# EAGLE design WaveTooEasy_V1.2 (EAGLE 7.6.0)
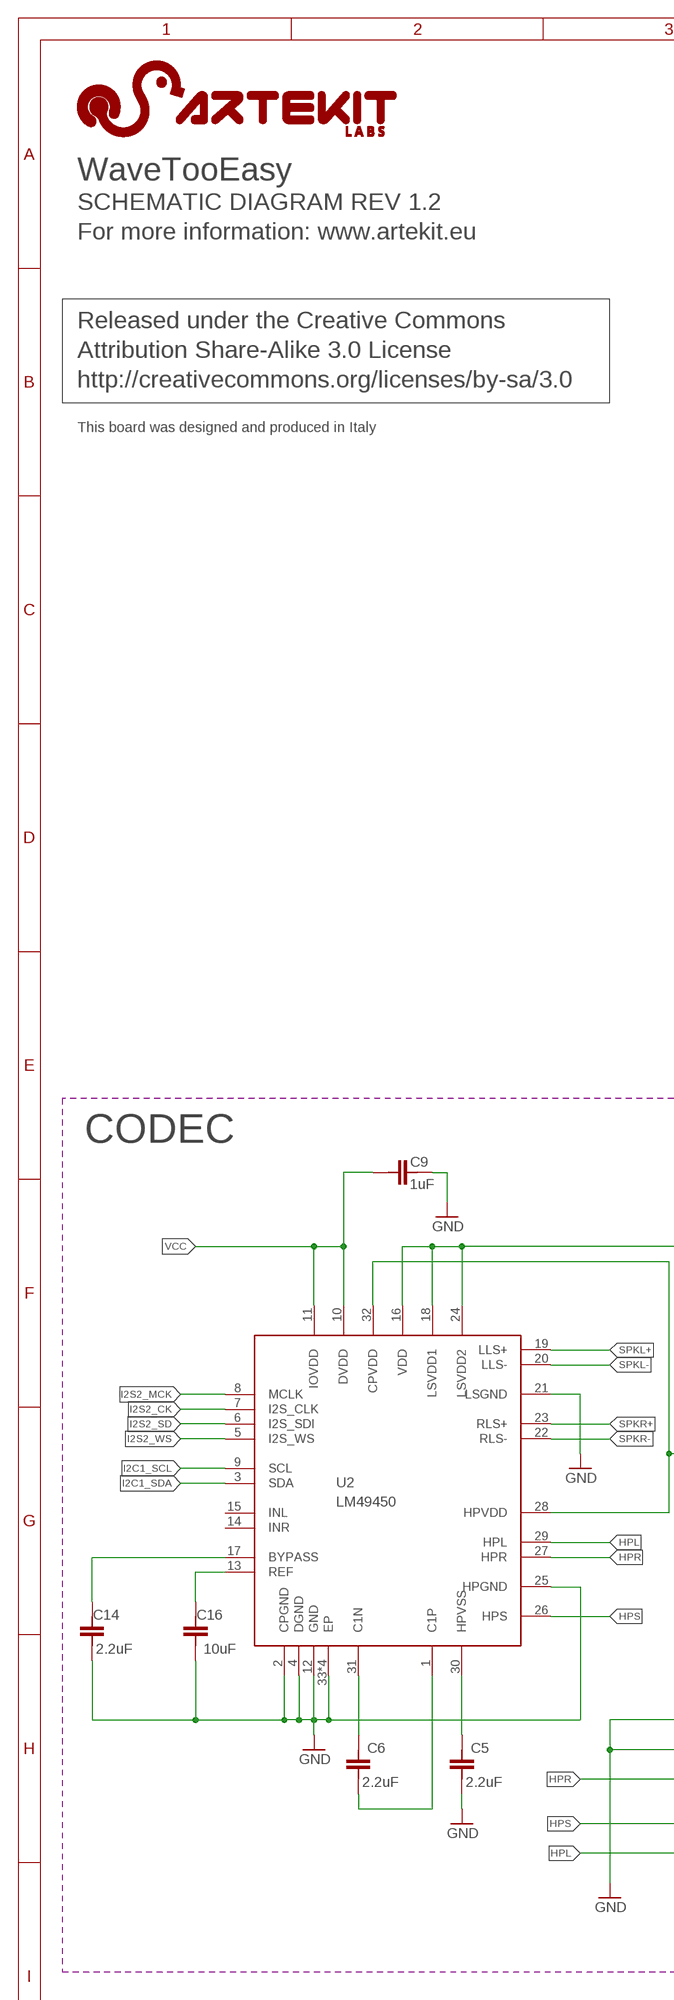
[diagram p0: schematic, sheet 1, part 1 of 2]
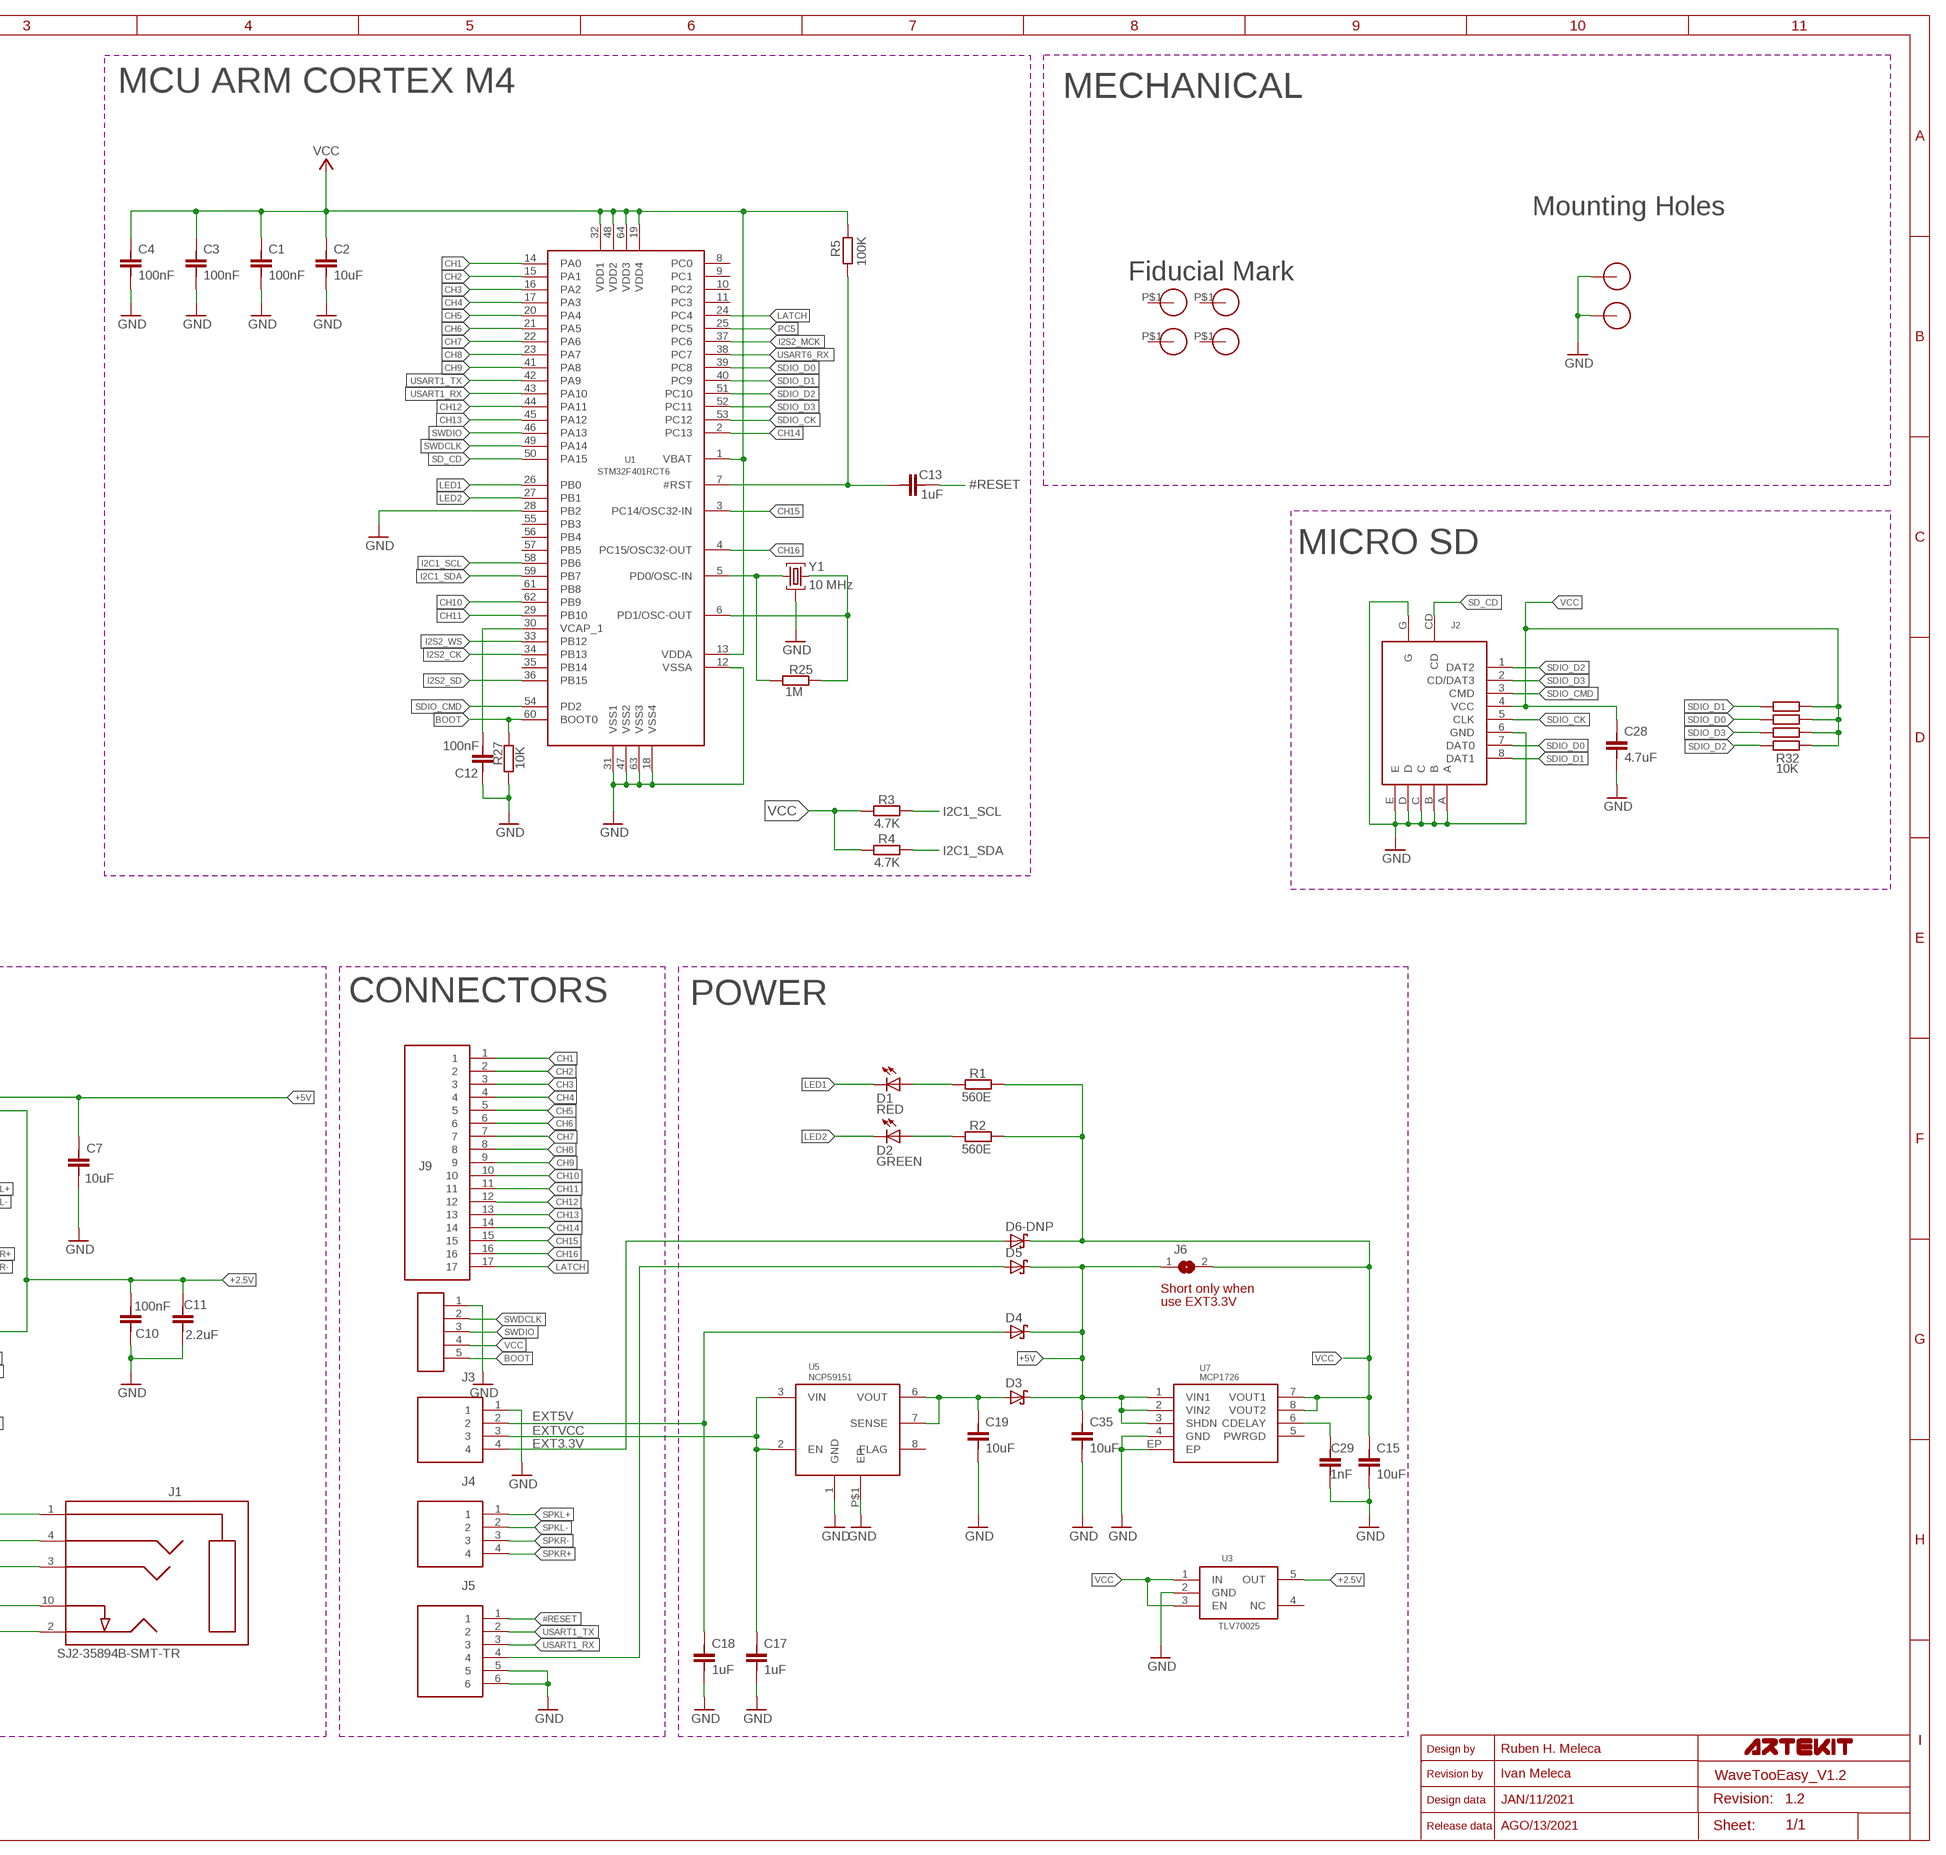
[diagram p1: schematic, sheet 1, part 2 of 2]

## Parts
C1  100nF  C0402  [C0402]
C2  10uF  C0402  [C0402]
C3  100nF  C0402  [C0402]
C4  100nF  C0402  [C0402]
C5  2.2uF  C0402  [C0402]
C6  2.2uF  C0402  [C0402]
C7  10uF  C0402  [C0402]
C9  1uF  C0402  [C0402]
C10  100nF  C0402  [C0402]
C11  2.2uF  C0402  [C0402]
C12  100nF  C0402  [C0402]
C13  1uF  C0402  [C0402]
C14  2.2uF  C0402  [C0402]
C15  10uF  C0402  [C0402]
C16  10uF  C0402  [C0402]
C17  1uF  C0402  [C0402]
C18  1uF  C0402  [C0402]
C19  10uF  C0402  [C0402]
C28  4.7uF  C0402  [C0402]
C29  1nF  C0402  [C0402]
C35  10uF  C0402  [C0402]
D1  RED  LED0603-RED  [CHIPLED_0603]
D2  GREEN  LED0603-RED  [CHIPLED_0603]
D3  BAT60  DIO-SCHOTTKY-10V-1A-BAT60JFILM  [SOD-323]
D4  BAT60  DIO-SCHOTTKY-10V-1A-BAT60JFILM  [SOD-323]
D5  BAT60  DIO-SCHOTTKY-10V-1A-BAT60JFILM  [SOD-323]
D6-DNP  BAT60  DIO-SCHOTTKY-10V-1A-BAT60JFILM  [SOD-323]
J1  SJ2-35894B-SMT-TR  [SJ2-35894B-SMT-TR]
J2  MICRO-SD-CON-MOLEX-503182-0852  [MICRO-SD-CON-MOLEX-503182-0852]
J3  CON-PH-1X04-P01"2  [PIN-HEADER-1X04-NODASH]
J4  CON-PH-1X04-P01"2  [PIN-HEADER-1X04-NODASH]
J5  CON-PH-1X06-P0.1"1  [PIN-HEADER-1X6-NODASH]
J6  JUMPER-2  [JUMPER-2]
J9  CON-PH-1X17-P0.1  [PIN-HEADER-1X17-NODASH]
R1  560E  R0402  [R0402]
R2  560E  R0402  [R0402]
R3  4.7K  R0402  [R0402]
R4  4.7K  R0402  [R0402]
R5  100K  R0402  [R0402]
R25  1M  R0402  [R0402]
R27  10K  R0402  [R0402]
R32  10K  RESISTOR-ARRAY-X4-0603  [RES-ARRAY-0603]
U1  STM32F401RCT6  STM32F401RBT6  [LQFP64-10X10-P0.50]
U2  LM49450  [QFN32-5X5-P0.50]
U3  TLV70025  REG-TLV70025DCKR-2.5V-200MA  [SOT363-5]
U5  NCP59151  NCP59151MN50TYG  [DFN8-4X4]
U7  MCP1726  MCP1726-3.3V-DFN8-3X3  [DFN8-3X3]
U$1  CON-PH-1X05-P0.1"  [PIN-HEADER-1X05-NODASH]
U$3  HOLE-2MM-METALIZED  [HOLE-2MM-METALIZED]
U$4  HOLE-2MM-METALIZED  [HOLE-2MM-METALIZED]
U$5  FIDUTIAL_1.2MM  [FIDUTIAL_1.2MM]
U$6  FIDUTIAL_1.2MM  [FIDUTIAL_1.2MM]
U$8  FIDUTIAL_1.2MM  [FIDUTIAL_1.2MM]
U$9  FIDUTIAL_1.2MM  [FIDUTIAL_1.2MM]
Y1  10 MHz  RESONATOR-MURATA-CSTCE8M00G55-R0  [RESONATOR-MURATA-CSTCE-SERIES]

## Nets
#RESET: C13.2 J5.1
+2.5V: C10.1 C11.1 U2.28(HPVDD) U2.32(CPVDD) U3.5(OUT)
+5V: C7.1 C35.1 D3.C D4.C D5.C J6.1 U2.16(VDD) U2.18(LSVDD1) U2.24(LSVDD2) U7.1(VIN1) U7.2(VIN2) U7.3(SHDN)
BOOT: R27.2 U1.60(BOOT0) U$1.5
CH1: J9.1 U1.14(PA0)
CH2: J9.2 U1.15(PA1)
CH3: J9.3 U1.16(PA2)
CH4: J9.4 U1.17(PA3)
CH5: J9.5 U1.20(PA4)
CH6: J9.6 U1.21(PA5)
CH7: J9.7 U1.22(PA6)
CH8: J9.8 U1.23(PA7)
CH9: J9.9 U1.41(PA8)
CH10: J9.10 U1.62(PB9)
CH11: J9.11 U1.29(PB10)
CH12: J9.12 U1.44(PA11)
CH13: J9.13 U1.45(PA12)
CH14: J9.14 U1.2(PC13)
CH15: J9.15 U1.3(PC14/OSC32-IN)
CH16: J9.16 U1.4(PC15/OSC32-OUT)
EXT3.3V: D6-DNP.A J3.4
EXT5V: C18.1 D4.A J3.2
EXTVCC: C17.1 J3.3 U5.2(EN) U5.3(VIN)
GND: C1.2 C2.2 C3.2 C4.2 C5.2 C7.2 C9.2 C10.2 C11.2 C12.2 C14.2 C15.2 C16.2 C17.2 C18.2 C19.2 C28.2 C29.2 C35.2 J1.1 J1.4 J2.6(GND) J2.A J2.B J2.C J2.D J2.E J2.G J3.1 J5.5 J5.6 R27.1 U1.12(VSSA) U1.18(VSS4) U1.28(PB2) U1.31(VSS1) U1.47(VSS2) U1.63(VSS3) U2.2(CPGND) U2.4(DGND) U2.12(GND) U2.21(LSGND) U2.25(HPGND) U2.33(EP) U2.34(EP) U2.35(EP) U2.36(EP) U3.2(GND) U5.1(GND) U5.P$1(EP) U7.4(GND) U7.EP U$1.1 U$3.1 U$4.1 Y1.2
HPL: J1.2 U2.29(HPL)
HPR: J1.3 U2.27(HPR)
HPS: J1.10 U2.26(HPS)
I2C1_SCL: R3.1 U1.58(PB6) U2.9(SCL)
I2C1_SDA: R4.1 U1.59(PB7) U2.3(SDA)
I2S2_CK: U1.34(PB13) U2.7(I2S_CLK)
I2S2_MCK: U1.37(PC6) U2.8(MCLK)
I2S2_SD: U1.36(PB15) U2.6(I2S_SDI)
I2S2_WS: U1.33(PB12) U2.5(I2S_WS)
LATCH: J9.17 U1.24(PC4)
LED1: D1.C U1.26(PB0)
LED2: D2.C U1.27(PB1)
N$1: C19.1 D3.A U5.6(VOUT) U5.7(SENSE)
N$2: C6.1 U2.31(C1N)
N$3: C6.2 U2.1(C1P)
N$4: C5.1 U2.30(HPVSS)
N$5: C16.1 U2.13(REF)
N$6: C14.1 U2.17(BYPASS)
N$8: D5.A J5.4
N$9: C13.1 R5.1 U1.7(#RST)
N$10: R25.1 U1.5(PD0/OSC-IN) Y1.1
N$11: R25.2 U1.6(PD1/OSC-OUT) Y1.3
N$12: D2.A R2.2
N$13: D1.A R1.2
N$41: C29.1 U7.6(CDELAY)
N$42: C12.1 U1.30(VCAP_1)
PC5: U1.25(PC5)
SD_CD: J2.CD U1.50(PA15)
SDIO_CK: J2.5(CLK) U1.53(PC12)
SDIO_CMD: J2.3(CMD) U1.54(PD2)
SDIO_D0: J2.7(DAT0) R32.3 U1.39(PC8)
SDIO_D1: J2.8(DAT1) R32.1 U1.40(PC9)
SDIO_D2: J2.1(DAT2) R32.7 U1.51(PC10)
SDIO_D3: J2.2(CD/DAT3) R32.5 U1.52(PC11)
SPKL+: J4.1 U2.19(LLS+)
SPKL-: J4.2 U2.20(LLS-)
SPKR+: J4.4 U2.23(RLS+)
SPKR-: J4.3 U2.22(RLS-)
SWDCLK: U1.49(PA14) U$1.2
SWDIO: U1.46(PA13) U$1.3
USART1_RX: J5.3 U1.43(PA10)
USART1_TX: J5.2 U1.42(PA9)
USART6_RX: U1.38(PC7)
VCC: C1.1 C2.1 C3.1 C4.1 C9.1 C15.1 C28.1 D6-DNP.C J2.4(VCC) J6.2 R1.1 R2.1 R3.2 R4.2 R5.2 R32.2 R32.4 R32.6 R32.8 U1.1(VBAT) U1.13(VDDA) U1.19(VDD4) U1.32(VDD1) U1.48(VDD2) U1.64(VDD3) U2.10(DVDD) U2.11(IOVDD) U3.1(IN) U3.3(EN) U7.7(VOUT1) U7.8(VOUT2) U$1.4
Unconnected: U1.8(PC0) U1.9(PC1) U1.10(PC2) U1.11(PC3) U1.35(PB14) U1.55(PB3) U1.56(PB4) U1.57(PB5) U1.61(PB8) U2.14(INR) U2.15(INL) U3.4(NC) U5.8(FLAG) U7.5(PWRGD) U$5.P$1 U$6.P$1 U$8.P$1 U$9.P$1

## Notes on the sheet
- MCU ARM CORTEX M4 | MECHANICAL
- WaveTooEasy
- SCHEMATIC DIAGRAM REV 1.2
- For more information: www.artekit.eu | Mounting Holes
- Fiducial Mark
- Released under the Creative Commons
- Attribution Share-Alike 3.0 License
- http://creativecommons.org/licenses/by-sa/3.0
- This board was designed and produced in Italy
- MICRO SD
- CODEC | CONNECTORS | POWER
- Short only when
- use EXT3.3V
- Design by | Ruben H. Meleca
- Revision by | Ivan Meleca
- Design data | JAN/11/2021 | Revision: | 1.2
- Release data | AGO/13/2021 | Sheet:

## Library data of the parts
C1-C7 C9-C19 C28 C29 C35 = artekit:C0402: CAP SMD 0402 NP; MF: unknown; MPN: unknown
D1 D2 = artekit:LED0603-RED: Standard LEDs - SMD Super Red, 633nm 180mcd, 20mA; MF: Osram; MPN: LTST-C191KRKT; OC_DIGIKEY: 475-2512-1-ND; OC_MOUSER: 720-LSQ976-NR-1
D3-D5 D6-DNP = artekit:DIO-SCHOTTKY-10V-1A-BAT60JFILM: Schottky Diodes & Rectifiers 3.0 Amp 10 Volt; MF: ST Microelectronics; MPN: BAT60JFILM; OC_DIGIKEY: 497-3707-1-ND; OC_FARNEL: 1467544; OC_MOUSER: 511-BAT60JFILM
J1 = ak:SJ2-35894B-SMT-TR: Jack SMD CUI SJ2-35894B-SMT-TR; MF: CUI Audio; MPN: SJ2-35894B-SMT-TR; OC_DIGIKEY: CP-SJ2-35894B-SMT-CT-ND; OC_MOUSER: 490-SJ2-35894BSMT-TR
J2 = artekit:MICRO-SD-CON-MOLEX-503182-0852: MicroSD connector Molex 503182-0852; MF: Molex; MPN: 503182-1852; OC_MOUSER: 538-503182-1852
J3 J4 = artekit:CON-PH-1X04-P01"
J5 = artekit:CON-PH-1X06-P0.1": CON-Pin Header 1x06 Pitch 0.1"; MF: unknown; MPN: unknown
J6 = artekit:JUMPER-2: 2-Way Solder Option; MF: unknown; MPN: unknown
J9 = ak:CON-PH-1X17-P0.1
R1-R5 R25 R27 = artekit:R0402: RES SMD 0402; MF: unknown; MPN: unknown
R32 = artekit:RESISTOR-ARRAY-X4-0603: Resistor Array X4 0603
U1 = ak:STM32F401RBT6: ARM Cortex M4 STM32F401RBT6 LFP64; MF: ST Microelectronics; MPN: STM32F401RCT6; OC_MOUSER: 511-STM32F401RCT6
U2 = ak:LM49450: LM49450 Stereo Codec with Class D amplifier and Headphones; MF: Texas Instruments; MPN: LM49450SQ; OC_DEGIKEY: LM49450SQ/NOPBCT-ND; OC_MOUSER: 26-LM49450SQ/NOPB
U3 = artekit:REG-TLV70025DCKR-2.5V-200MA: 2.5V 200mA LDO Regulator; MF: Texas Instruments; MPN: TLV70025DCKR; OC_MOUSER: 595-TLV70025DCKR
U5 = artekit:NCP59151MN50TYG: 5V 1.5 A, Very Low-Dropout(VLDO) Fast TransientResponse Regulator Series; MF: ON Semiconductors; MPN: NCP59151MN50TYG; OC_DIGIKEY: NCP59151MN50TYGOSTR-ND; OC_MOUSER: 863-NCP59151MN50TYG
U7 = artekit:MCP1726-3.3V-DFN8-3X3: 1A 3.3V Low Quiescent Current LDO Regulator; MF: Microchip; MPN: MCP1726T-3302E/MF; OC_DIGIKEY: MCP1726T-3302E/MF-ND; OC_FARNELL: 1851970; OC_MOUSER: 579-MCP1726T3302E/MF
U$1 = ak:CON-PH-1X05-P0.1"
U$3 U$4 = artekit:HOLE-2MM-METALIZED: Metalized hole 2mm
U$5 U$6 U$8 U$9 = artekit:FIDUTIAL_1.2MM
Y1 = ak:RESONATOR-MURATA-CSTCE8M00G55-R0: Resonator 8MHz 0.5%; MF: Murata; MPN: CSTCE8M00G55-R0; OC_DIGIKEY: 490-1195-1-ND; OC_FARNELL: 2443270; OC_MOUSER: 81-CSTCE8M00G55-R0

## Board
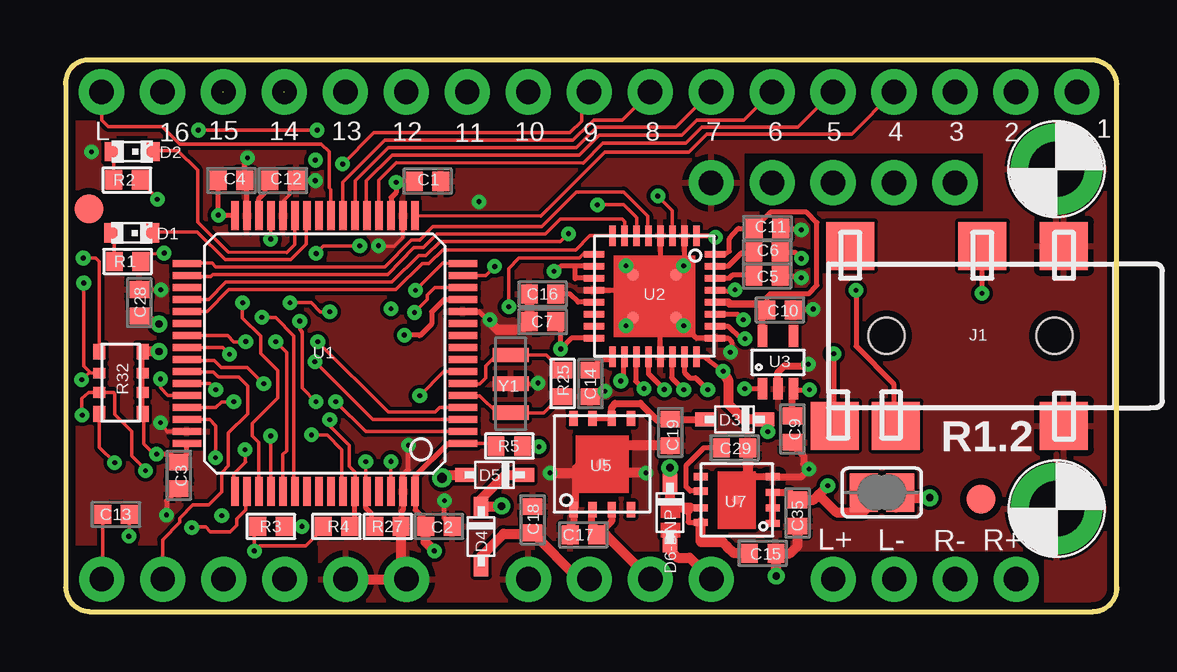
[diagram p2: board, top side]
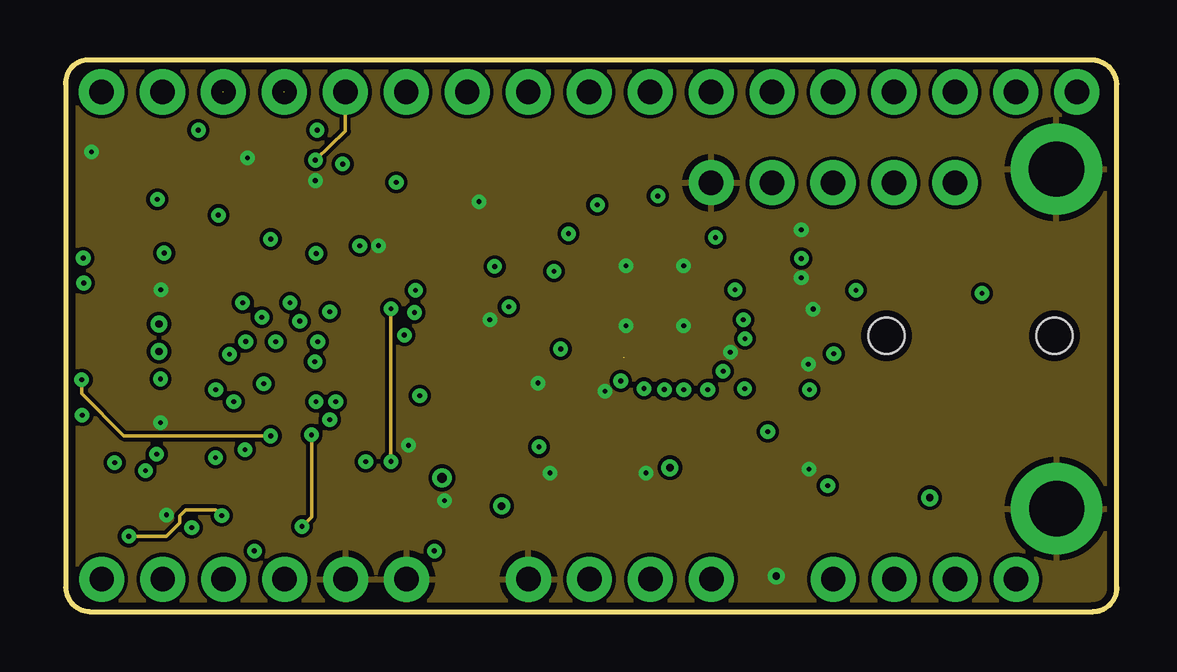
[diagram p3: board, inner layer GND]
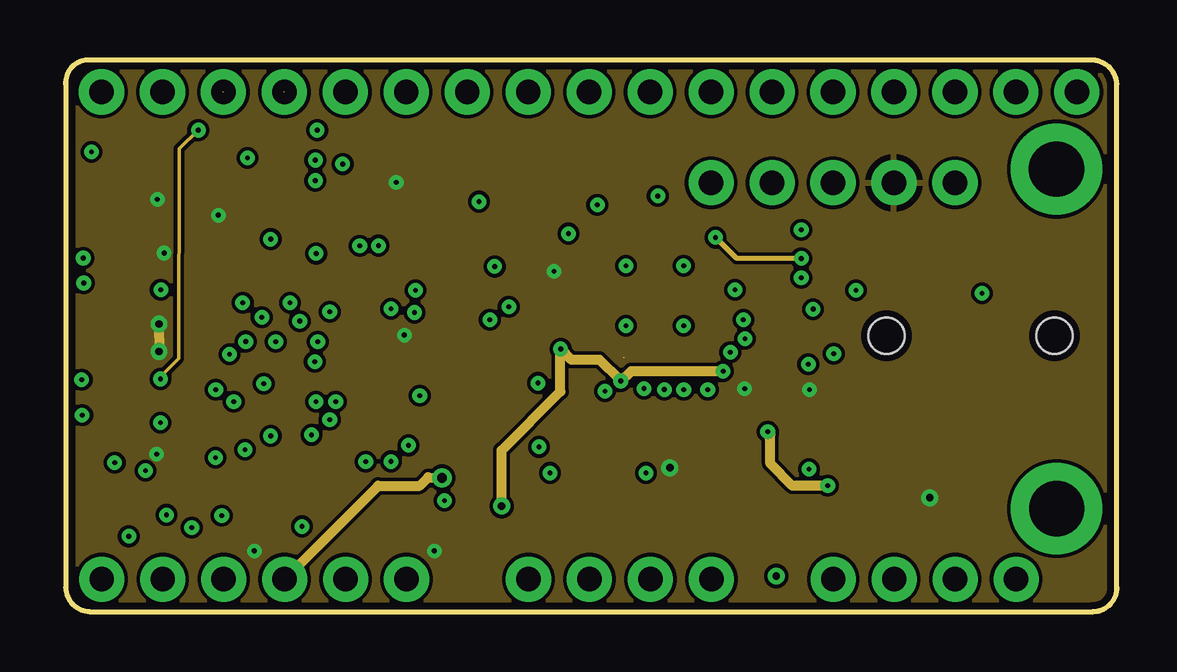
[diagram p4: board, inner layer VCC]
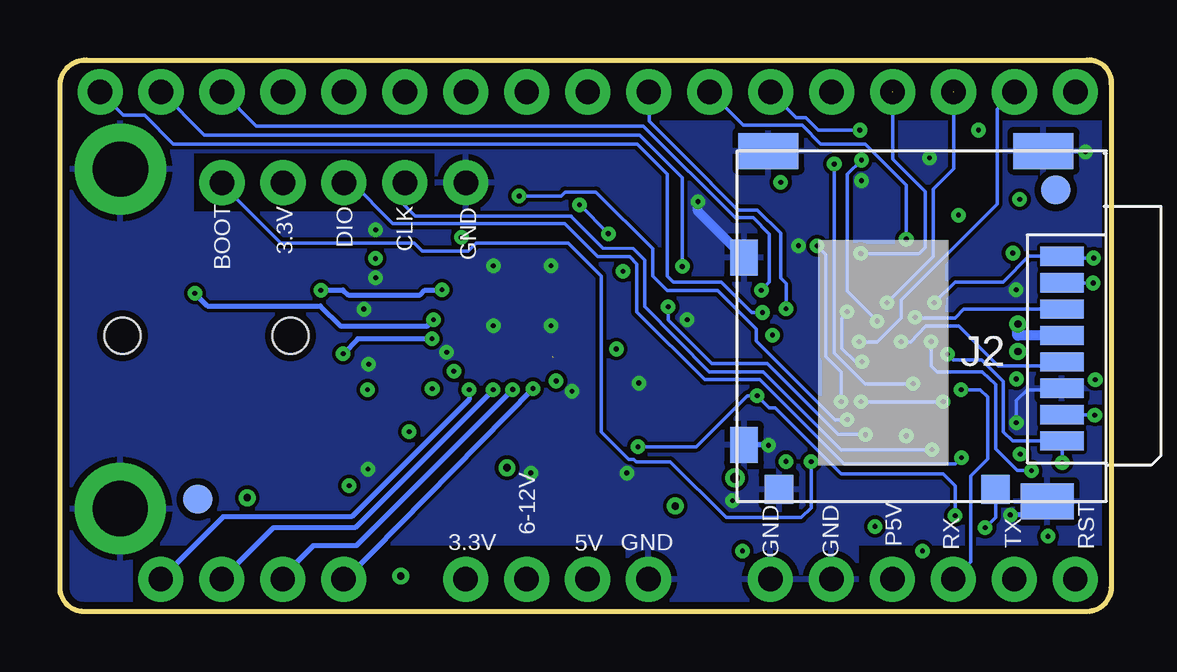
[diagram p5: board, bottom side, seen from below]

Size 43.8 x 23 mm. Coordinates in mm from the lower left corner, seen from the top.
Outline: 1,0 42.8,0 arc90 43.8,1 43.8,22 arc88 42.7,23 1,23 arc97 0,22 0,1 arc87 1,0
Copper layers (1*16): Top 0.035mm / dielectric 1.5mm / Bottom 0.035mm
Design rules "artekit": minimum track width 0.15mm, minimum drill 0.2mm, track to track 0.15mm, track to pad 0.15mm, pad to pad 0.2mm, via to via 0.15mm, smd to smd 0mil, copper to edge 0.3mm, drill to drill 8mil, minimum pad ring 10mil, minimum via ring 8mil, stop-mask expansion 4mil, vias tented up to drill 20mil, thermal gap 10mil
tRestrict: area 0.3,20.5 to 43.5,22.8; area 0.3,0.2 to 10.5,2.8; area 20.3,0.2 to 40.8,2.5; area 28.3,16.7 to 38.2,19.1
bRestrict: area 0.3,20.5 to 43.5,22.8; area 0.3,0.2 to 10.5,2.8; area 20.3,0.2 to 40.8,2.8; area 28.2,16.7 to 38.2,19.1

### Footprints (pad centres in the part's own frame; a part is rotated, then mirrored left to right if it is on the bottom)
C0402 = smd 0.7 x 0.8: 1 -0.55,0; 2 0.55,0
CHIPLED_0603 = smd 0.8 x 0.8: A 0,-0.75; C 0,0.75
SOD-323 = smd 0.8 x 0.6: A 1.25,0; C -1.25,0
SJ2-35894B-SMT-TR = smd 2 x 2: 1 2.1,-3.75; 2 9.1,3.75; 3 5.5,-3.75; 4 2.1,3.75; 10 11.65,3.75; 11 11,-3.75 | hole 1.5: 2.5,0; 9.5,0
MICRO-SD-CON-MOLEX-503182-0852 = smd 0.8 x 1.8: 1 -3.31,6.15; 2 -2.21,6.15; 3 -1.11,6.15; 4 -0.01,6.15; 5 1.09,6.15; 6 2.19,6.15; 7 3.29,6.15; 8 4.39,6.15 | smd 1.5 x 2.5: A -7.7,5.37; B -7.7,-6.08 | smd 1.5 x 1.15: C -3.27,-7.1; D 4.55,-7.1 | smd 1.2 x 1.2: CD 6.4,3.38; G 6.4,-5.64 | smd 1.5 x 2.2: E 6.9,5.53
PIN-HEADER-1X04-NODASH = drill 1.016 pad 1.88: 1 0,0; 2 2.54,0; 3 5.08,0; 4 7.62,0
PIN-HEADER-1X6-NODASH = drill 1.016 pad 1.88: 1 0,0; 2 2.54,0; 3 5.08,0; 4 7.62,0; 5 10.16,0; 6 12.7,0
JUMPER-2 = smd 1.168 x 1.6: 1 -0.762,0; 2 0.762,0
PIN-HEADER-1X17-NODASH = drill 1.016 pad 1.88: 1 0,0; 2 2.54,0; 3 5.08,0; 4 7.62,0; 5 10.16,0; 6 12.7,0; 7 15.24,0; 8 17.78,0; 9 20.32,0; 10 22.86,0; 11 25.4,0; 12 27.94,0; 13 30.48,0; 14 33.02,0; 15 35.56,0; 16 38.1,0; 17 40.64,0
R0402 = smd 0.7 x 0.8: 1 -0.55,0; 2 0.55,0
RES-ARRAY-0603 = smd 0.65 x 0.5: 1 -1.3,0.9; 2 -1.3,-0.9; 7 1.3,0.9; 8 1.3,-0.9 | smd 0.45 x 0.5: 3 -0.4,0.9; 4 -0.4,-0.9; 5 0.4,0.9; 6 0.4,-0.9
LQFP64-10X10-P0.50 = smd 1.2 x 0.3: 1 -5.75,3.75; 2 -5.75,3.25; 3 -5.75,2.75; 4 -5.75,2.25; 5 -5.75,1.75; 6 -5.75,1.25; 7 -5.75,0.75; 8 -5.75,0.25; 9 -5.75,-0.25; 10 -5.75,-0.75; 11 -5.75,-1.25; 12 -5.75,-1.75; 13 -5.75,-2.25; 14 -5.75,-2.75; 15 -5.75,-3.25; 16 -5.75,-3.75; 33 5.75,-3.75; 34 5.75,-3.25; 35 5.75,-2.75; 36 5.75,-2.25; 37 5.75,-1.75; 38 5.75,-1.25; 39 5.75,-0.75; 40 5.75,-0.25; 41 5.75,0.25; 42 5.75,0.75; 43 5.75,1.25; 44 5.75,1.75; 45 5.75,2.25; 46 5.75,2.75; 47 5.75,3.25; 48 5.75,3.75 | smd 0.3 x 1.2: 17 -3.75,-5.75; 18 -3.25,-5.75; 19 -2.75,-5.75; 20 -2.25,-5.75; 21 -1.75,-5.75; 22 -1.25,-5.75; 23 -0.75,-5.75; 24 -0.25,-5.75; 25 0.25,-5.75; 26 0.75,-5.75; 27 1.25,-5.75; 28 1.75,-5.75; 29 2.25,-5.75; 30 2.75,-5.75; 31 3.25,-5.75; 32 3.75,-5.75; 49 3.75,5.75; 50 3.25,5.75; 51 2.75,5.75; 52 2.25,5.75; 53 1.75,5.75; 54 1.25,5.75; 55 0.75,5.75; 56 0.25,5.75; 57 -0.25,5.75; 58 -0.75,5.75; 59 -1.25,5.75; 60 -1.75,5.75; 61 -2.25,5.75; 62 -2.75,5.75; 63 -3.25,5.75; 64 -3.75,5.75
QFN32-5X5-P0.50 = smd 0.85 x 0.27: 1 -2.525,1.75; 2 -2.525,1.25; 3 -2.525,0.75; 4 -2.525,0.25; 5 -2.525,-0.25; 6 -2.525,-0.75; 7 -2.525,-1.25; 8 -2.525,-1.75; 17 2.525,-1.75; 18 2.525,-1.25; 19 2.525,-0.75; 20 2.525,-0.25; 21 2.525,0.25; 22 2.525,0.75; 23 2.525,1.25; 24 2.525,1.75 | smd 0.27 x 0.85: 9 -1.75,-2.525; 10 -1.25,-2.525; 11 -0.75,-2.525; 12 -0.25,-2.525; 13 0.25,-2.525; 14 0.75,-2.525; 15 1.25,-2.525; 16 1.75,-2.525; 25 1.75,2.525; 26 1.25,2.525; 27 0.75,2.525; 28 0.25,2.525; 29 -0.25,2.525; 30 -0.75,2.525; 31 -1.25,2.525; 32 -1.75,2.525 | smd 0.5 x 0.5: 33 -0.9,0.9; 34 -0.9,-0.9; 35 0.9,-0.9; 36 0.9,0.9
SOT363-5 = smd 0.4 x 0.9: 1 -0.65,-1.1; 2 0,-1.1; 3 0.65,-1.1; 4 0.65,1.1; 5 -0.65,1.1
DFN8-4X4 = smd 0.63 x 0.35: 1 -1.9,1.2; 2 -1.9,0.4; 3 -1.9,-0.4; 4 -1.9,-1.2; 5 1.9,-1.2; 6 1.9,-0.4; 7 1.9,0.4; 8 1.9,1.2 | smd 0.5 x 0.5: P$1 0,0
DFN8-3X3 = smd 0.6 x 0.3: 1 -1.5,0.975; 2 -1.5,0.325; 3 -1.5,-0.325; 4 -1.5,-0.975; 5 1.5,-0.975; 6 1.5,-0.375; 7 1.5,0.325; 8 1.5,0.925 | smd 0.4 x 0.4: EP 0,0
PIN-HEADER-1X05-NODASH = drill 1.016 pad 1.88: 1 0,0; 2 2.54,0; 3 5.08,0; 4 7.62,0; 5 10.16,0
HOLE-2MM-METALIZED = drill 2.3 pad 3.81: 1 0,0
FIDUTIAL_1.2MM = smd 1.2 x 1.2: P$1 0,0
RESONATOR-MURATA-CSTCE-SERIES = smd 0.6 x 1.5: 1 -1.2,0; 2 0,0; 3 1.2,0

### Placement (x,y rotation side)
C1  15.08,17.94 0 top
C2  15.55,3.55 0 top
C3  4.71,5.68 270 top
C4  6.91,17.98 0 top
C5  29.23,14 0 top
C6  29.23,14.99 0 top
C7  19.87,12.09 180 top
C9  30.28,7.61 270 top
C10  29.76,12.58 0 top
C11  29.24,15.98 0 top
C12  9.05,17.98 0 top
C13  2.09,4.05 180 top
C14  21.86,9.51 270 top
C15  29.04,2.43 0 top
C16  19.87,13.24 180 top
C17  21.57,3.2 180 top
C18  19.45,3.83 90 top
C19  25.19,7.47 270 top
C28  3.07,12.88 90 top
C29  27.87,6.83 0 top
C35  30.49,4.11 270 top
D1  2.75,15.79 270 top
D2  2.77,19.18 270 top
D3  27.87,8.01 180 top
D4  17.31,3.13 270 top
D5  17.87,5.7 180 top
D6-DNP  25.18,4.12 270 top
J1  43.69,11.5 180 top
J2  8.2,11.5 270 bottom
J3  19.28,1.35 0 top
J4  31.98,1.35 0 top
J5  1.5,1.35 0 top
J6  34.01,4.97 0 top
J9  42.13,21.67 180 top
R1  2.58,14.6 180 top
R2  2.55,18 180 top
R3  8.55,3.55 180 top
R4  11.28,3.55 180 top
R5  18.48,6.9 180 top
R25  20.7,9.51 90 top
R27  13.42,3.55 180 top
R32  2.3,9.54 90 top
U1  10.8,10.76 180 top
U2  24.53,13.15 270 top
U3  29.68,10.39 0 top
U5  22.35,6.15 90 top
U7  27.96,4.65 180 top
U$1  26.89,17.88 0 top
U$3  41.28,18.45 0 top
U$4  41.29,4.29 0 top
U$5  38.14,4.68 0 top
U$6  0.96,16.79 0 top
U$8  38.06,4.68 0 bottom
U$9  2.31,17.58 0 bottom
Y1  18.54,9.5 90 top

### Tracks (layer width: path | path; a pad name or v marks a point on that pad's centre or on a via)
#RESET
  Top 0.15: J5.1 1.54,1.39 C13.2
+2.5V
  Top 0.2: U2.32 27.48,14.9 27.65,15.02 27.65,15.55 28.03,15.98 C11.1 29.36,16.65 30.88,16.65 31.3,16.23 31.3,13.6 30.95,13.25 29.35,13.25 29.2,13.1 29.2,12.53 C10.1
  Top 0.3: U3.5 29.03,12.48 C10.1
  Top 0.305: U2.28 27.6,12.9 27.68,12.83 28.91,12.83 C10.1
+5V  (via drill 0.2, 0.3)  (1 unrouted)
  Top 0.2: v23.13,9.62 23.1,9.6 23.25,9.75 23.25,10.59 | v27.39,10.02 26.61,10.62 U2.24 | C7.1 20.62,11.89 v20.62,10.95 21.07,11.4 U2.16
  Top 0.3: U7.1 U7.2 U7.3 30.18,4.98 C35.1 30.25,4.9 | D3.C 29.24,8.01 29.25,8
  Top 0.406: D3.C | D3.C 28.25,8.01 27.62,8.64 27.62,9.61 v27.39,10.02 | C35.1 31.16,4.66 31.38,4.88 | 31.38,4.88 v31.75,5.25 | v29.25,7.5 29.25,7.88 D3.C | 31.38,4.88 32.11,4.14 33.22,4.14 33.3,4.23 33.3,4.91 J6.1 | D5.C 18.31,5.69 17.31,4.69 D4.C 18.14,4.38 v18.16,4.4
  VCC 0.406: v27.39,10.02 23.55,10.02 v23.13,9.62 23.1,9.65 22.25,10.5 21.07,10.5 v20.62,10.95 v20.61,10.94 20.61,9.17 18.16,6.72 v18.16,4.4 | v31.75,5.25 30.28,5.25 29.36,6.17 29.36,7.39 v29.25,7.5
BOOT  (via drill 0.2)
  Top 0.15: v12.5,6.25 12.5,5.06 U1.60
  Top 0.2: R27.2 12.76,3.66 12.76,4.07 12.5,4.33 12.5,4.46 12.55,4.51 U1.60
  Bottom 0.15: U$1.5 37.05,17.81 34.61,15.37 34.61,15.38 29.05,15.38 28.7,15.02 26.8,15.02 26.46,15.37 22.62,15.37 21.25,14 21.25,7.5 20.1,6.35 19.9,6.35 19.8,6.25 18.38,6.25 16.05,3.92 12.91,3.92 12.5,4.33 v12.5,6.25
CH1  (via drill 0.2)
  Top 0.15: U1.14 15.38,13.51 15.07,13.2 15.07,13.01 v14.53,12.47
  Bottom 0.15: v14.53,12.47 14.97,12.47 16.25,13.75 18.25,13.75 18.5,14 18.5,18.25 19.75,19.5 39.08,19.5 40.28,20.7 41.16,20.7 J9.1
CH2  (via drill 0.2)
  Top 0.15: U1.15 17.49,14.01 v17.87,14.39
  Bottom 0.15: v17.87,14.39 17.87,18.1 19.64,19.87 37.79,19.87 J9.2
CH3  (via drill 0.2)
  Top 0.15: U1.16 15.71,14.53 v14.58,13.4
  Bottom 0.15: v14.58,13.4 14.25,13.75 14.25,15.75 14.92,16.42 15.67,16.42 19.5,20.25 35.63,20.25 J9.3
CH4
  Top 0.15: U1.17 19.79,16.48 22.45,19.15 25.95,19.15 26.7,19.9 32.74,19.9 J9.4
CH5
  Top 0.15: U1.20 13.04,17.98 13.78,18.72 21.56,18.7 22.37,19.53 25.83,19.53 26.5,20.2 30.5,20.2 J9.5
CH6
  Top 0.15: U1.21 12.53,16.53 12.53,17.97 13.6,19.03 21.39,19.03 22.23,19.88 25.68,19.88 26.3,20.5 28.26,20.5 J9.6
CH7
  Top 0.15: U1.22 12.06,17.97 13.44,19.35 21.28,19.35 22.12,20.2 25.42,20.2 J9.7
CH8
  Top 0.15: U1.23 11.55,17.9 13.3,19.65 21.13,19.65 21.81,20.33 21.83,20.33 22,20.5 23.18,20.5 J9.8
CH9  (via drill 0.2)
  Top 0.15: v11.54,18.66 12.84,19.96 21.01,19.96 21.5,20.45 21.5,21.36 J9.9 | U1.41 5.09,10.47 6.18,10.47 6.47,10.18 6.47,10.17 7.57,10.17 v8.24,9.5 v8.25,9.5
  Bottom 0.15: v11.54,18.66 11.54,10.79 10.25,9.5 v8.25,9.5
CH10  (via drill 0.2)
  Top 0.15: U1.62 v13.55,6.26
  GND 0.15: v13.55,6.26 v13.55,12.63
  Bottom 0.15: J9.10 19.25,21.65 19.25,20.45 16.68,17.88 16.68,17.87 15.56,16.75 14.75,16.75 13.78,15.77 13.78,13.9 13.55,13.67 v13.55,12.63
CH11  (via drill 0.2)
  Top 0.15: U1.29 8.55,15.39 v8.54,15.53
  Bottom 0.15: v8.54,15.53 8.54,17.79 10.25,19.5 12.1,19.5 12.88,20.27 15.34,20.27 J9.11
CH12  (via drill 0.2)
  Top 0.15: U1.44 4.24,9.01 3.95,9.33 v3.95,9.7 | v5.53,20.08 v10.48,20.08
  VCC 0.15: v3.95,9.7 3.98,9.83 4.7,10.55 4.73,19.3 v5.53,20.08
  Bottom 0.15: J9.12 13.12,20.6 12.73,20.6 12.2,20.08 v10.48,20.08
CH13  (via drill 0.2)
  Top 0.15: U1.45 6.26,8.51 6.5,8.75 v7,8.75 | v10.43,8.75 9.85,9.33 9.85,11.63 9.75,11.8 v9.75,12.11
  GND 0.15: v10.4,18.83 11.65,20.02 J9.13
  Bottom 0.15: v10.43,8.75 v7,8.75 | v10.4,18.83 11,18.25 11,13.36 v9.75,12.11
CH14  (via drill 0.2)  (1 unrouted)
  Top 0.15: U1.2 12.49,7.51 v11.25,8.75 | v12.25,15.25 10.73,15.25 v10.44,14.93
  Bottom 0.15: v11.25,8.75 11.25,10 11.89,10.64 11.89,14.89 v12.25,15.25 | v10.44,14.93 8,14.93 7.75,15.17 7.75,17.51 9.1,18.86 J9.14
CH15  (via drill 0.2)  (1 unrouted)
  Top 0.15: U1.3 12.79,8.01 v10.38,10.42 | v11,12.5 10.6,12.5 10.22,12.88 v9.34,12.88
  Bottom 0.15: v10.38,10.42 10.67,10.42 11.23,10.98 11.23,12.23 v11,12.5 | v9.34,12.88 7.41,14.81 7.41,17.62 6.56,18.47 J9.15
CH16  (via drill 0.2)
  Top 0.15: v10.5,11.25 13.43,8.32 15.4,8.32 15.59,8.51 U1.4
  Bottom 0.15: v10.5,11.25 9.75,11.25 8.75,12.25 8.75,13 4.75,17 4.75,20.95 J9.16
EXT3.3V
  Top 0.406: D6-DNP.A 25.18,2.57 25.5,2.25 26,2.25 J3.4
EXT5V
  Top 0.406: D4.A 17.31,2.31 18.25,3.25 19.42,3.25 C18.1 21.38,1.35 J3.2
EXTVCC
  Top 0.3: U5.2 21.9,4.2 21.9,3.7 22.12,3.48 C17.1 22.18,3.2 22.75,3.77 U5.3
  Top 0.406: 22.18,3.2 22.51,3.2 J3.3
GND  (via drill 0.2, 0.3)
  Top 0.15: U1.47 4.26,7.51 4.25,7.5 4.23,7.5 v3.95,7.88 | U1.28 9.05,17.1 9.34,17.39 9.34,17.72 C12.2 | Y1.2 19.65,9.5 v19.68,9.53 | U1.18 14.05,15.6 13.69,15.24 13.05,15.24 v13.03,15.26 | C28.2 v3.96,13.42
  Top 0.2: U2.21 24.78,11.6 24.97,11.78 | 24.97,11.78 U2.36 26.28,11.4 U2.25 27.6,11.4 27.75,11.25 27.75,10.87 v27.69,10.81 | 24.97,11.78 24.5,12.25 U2.35 23.63,13.25 | 23.63,13.25 U2.34 24.75,14.05 | 24.75,14.05 U2.33 | 25.58,13.9 U2.33 | U2.4 24.78,14.08 24.75,14.05 | U2.2 25.78,14.4 U2.33 | U2.12 23.48,13.4 23.63,13.25 | U1.31 7.55,17.89 C4.2 7.46,18.81 v7.57,18.92 | C12.2 10.45,17.98 v10.4,17.97 | v30.65,15.92 30.18,15.92 C11.2 | C10.2 30.32,12.61 v31.14,12.61 | U1.12 17.25,12.5 17.58,12.17 v17.67,12.17 | v14.28,6.93 14.28,5.92 14.05,5.69 U1.63 14.07,4.99 14.07,4.27 13.97,4.17 R27.1 | C2.2 15.78,3.87 v15.78,4.63 | C3.2 4.2,4.62 v4.2,4.03 | C14.2 22.24,8.96 v22.47,9.19 | C5.2 30.57,14 v30.65,13.92
  Top 0.3: C17.2 21.02,3.6 21.16,3.74 U5.1 21.25,4.35 21.25,5.75 21.25,6 21.4,6.15 U5.P$1 | U7.EP 28,4.69 28,5.25 28.38,5.62 U7.4 30.66,5.62 v30.97,5.94 30.75,6.16 30.75,6.5 30.28,6.97 C9.2 | U3.2 29.67,9.97 29.94,10.25 30.88,10.25 v30.94,10.31
  Top 0.406: R27.1 13.97,1.58 J5.6 J5.5 | C16.2 C7.2 18.98,11.75 18,11.75 17.67,12.08 v17.67,12.17 | C29.2 28.42,5.67 28.38,5.62 | C35.2 30.5,2.75 30.18,2.43 C15.2 v29.59,1.49 v29.6,1.48 | C19.2 23.12,6.92 U5.P$1 22.72,5.78 v24.18,5.78 | v20.18,5.78 21.22,5.78 21.25,5.75
  Bottom 0.15: v3.95,7.88 3.95,8.8 3.5,9.25 2.11,9.25 J2.6 | J2.A 2.8,19.17 v1.07,19.17
  Bottom 0.2: v14.28,6.93 14.3,6.95 J2.D | J2.E 3.24,4.03 v4.2,4.03
  Bottom 0.406: J2.C 17.22,16.69 v17.22,17.09
  other vias: 25.75,14.42 25.75,11.92 23.35,14.42 23.35,11.92
  pour Top: -0.75,23.75 -0.75,-0.75 44.5,-0.75 44.5,23.75
  pour GND: -1.5,24.5 -1.5,-1.5 45.25,-1.5 45.25,24.5
  pour Bottom: -2.75,25.75 -2.75,-2.75 47,-2.75 47,25.75
HPL  (via drill 0.2)
  Top 0.2: U2.29 27.77,13.35 v27.89,13.41 | v32.93,13.4 32.93,11.07 34.5,9.5 34.5,7.84 J1.2
  Bottom 0.2: v32.93,13.4 32.72,13.41 32.02,13.41 31.8,13.2 28.8,13.2 28.6,13.4 27.9,13.4 v27.89,13.41
HPR  (via drill 0.2)
  Top 0.2: U2.27 27.98,12.4 v28.24,12.17 | v38.18,13.27 J1.3
  Bottom 0.2: v38.18,13.27 37.66,12.75 32.95,12.75 32.1,11.9 28.51,11.9 v28.24,12.17
HPS  (via drill 0.2)
  Top 0.2: U2.26 27.6,11.9 28.13,11.4 v28.3,11.38 | v32,10.75 32,7.79 J1.10
  Bottom 0.2: v28.3,11.38 31.4,11.38 v32,10.75
I2C1_SCL  (via drill 0.2)
  Top 0.15: U2.9 21.56,14.9 21.4,14.74 18.88,14.74 18.45,14.31 18.45,13.3 v18.46,12.71 | v10.24,7.37 10.9,7.37 11.5,6.75 11.5,5.06 U1.58
  Top 0.2: v9.84,3.55 R3.1
  GND 0.15: v9.84,3.55 10.24,3.95 v10.24,7.37
  Bottom 0.15: v18.46,12.71 18.46,12.16 16.64,10.34 14.34,10.34 11.37,7.38 v10.24,7.38 v10.24,7.37
I2C1_SDA  (via drill 0.2)
  Top 0.15: U2.3 25.28,16.72 v24.67,17.33 | v11,8 11,7.75 11.75,7 11.75,6.99 11.81,6.93 11.81,6.06 12.07,5.8 12.07,5.03 U1.59
  Top 0.2: R4.1 12.05,3.77 U1.59
  Bottom 0.15: v24.67,17.33 22.92,17.33 22.75,17.5 21.47,17.5 19.1,15.13 19.1,13.99 18.5,13.39 16.39,13.39 14.78,11.78 14.78,11.28 11.5,8 v11,8
I2S2_CK
  Top 0.15: U2.7 23.29,15.69 23.29,16.26 23.18,16.37 20.61,16.37 19.98,15.73 15.45,15.73 14.89,15.17 14.51,15.17 13.41,14.05 6.13,14.05 6.05,13.98 5.09,13.98 U1.34
I2S2_MCK
  Top 0.15: U1.37 5.9,12.51 6.79,13.42 13.76,13.42 14.85,14.52 15.13,14.52 15.72,15.08 21.24,15.08 21.84,15.68 U2.8
I2S2_SD  (via drill 0.2)
  Top 0.15: U1.36 5.96,13.01 6.67,13.74 13.59,13.74 14.71,14.84 15.01,14.84 15.6,15.42 20.6,15.42 v20.95,15.76 | U2.6 23.79,15.69 23.79,16.42 23.25,16.96 v22.15,16.96
  Bottom 0.15: v20.95,15.76 v22.15,16.96
I2S2_WS
  Top 0.15: U2.5 24.25,15.7 24.25,16.5 23.25,17.5 21.28,17.5 19.83,16.05 15.3,16.05 14.75,15.5 14.4,15.5 13.29,14.37 6.26,14.37 6.1,14.52 5.07,14.52 U1.33
LATCH
  Top 0.15: J9.17 1.5,20.5 1.78,20.22 4.03,20.22 4.75,19.5 10.65,19.5 10.98,19.17 10.98,17.67 11.05,17.6 U1.24
LED1
  Top 0.15: U1.26 10.03,15.33 9.37,14.67 6.64,14.68 5.48,15.82 3.53,15.82 D1.C
LED2
  Top 0.15: U1.27 9.55,15.3 9.21,14.98 6.78,14.99 5.5,16.25 5.5,18.41 4.67,19.21 3.55,19.21 D2.C
N$1
  Top 0.2: U5.7 U5.6
  Top 0.3: U5.6 22.75,8.5 22.89,8.68 23.94,8.68 24.64,7.97 25.17,8 C19.1 D3.A
N$2
  Top 0.2: U2.31 27.6,14.4 28.15,14.95 28.64,14.95 C6.1
N$3  (via drill 0.2)
  Top 0.2: U2.1 27,15.67 v27.08,15.6 | C6.2 30.39,14.99 v30.65,14.73
  VCC 0.2: v30.65,14.73 27.95,14.73 v27.08,15.6
N$4
  Top 0.2: U2.30 27.65,13.9 27.8,14.05 28.63,14.05 C5.1
N$5
  Top 0.2: U2.13 21.35,12.9 21,13.25 C16.1
N$6
  Top 0.2: U2.17 22.66,10.5 22.25,10.5 21.86,10.11 C14.1
N$8  (via drill 0.4)
  Top 0.406: v15.68,5.58 15.78,5.7 D5.A
  VCC 0.406: J5.4 13.02,5.25 14.75,5.25 15.1,5.6 v15.68,5.58
N$9  (via drill 0.2)
  Top 0.15: R5.1 19.06,6.87 v19.72,6.87 | v14.75,9 15.76,10.01 U1.7 | v2.63,3.14 v2.64,3.15 C13.1
  GND 0.15: v6.5,4 6.25,4.25 5,4.25 4.74,3.99 4.74,3.7 4.18,3.14 v2.63,3.14
  Bottom 0.15: v19.72,6.87 17.29,6.87 15.16,9 v14.75,9 14.25,8.5 14,8.5 11.25,5.75 7,5.75 6.5,5.25 v6.5,4
N$10
  Top 0.15: U1.5 17.25,9 17.95,8.3 Y1.1 19.92,8.29 20.59,8.96 R25.1
N$11
  Top 0.15: U1.6 17.25,9.5 17.5,9.75 17.5,10.25 17.95,10.7 Y1.3 20.03,10.7 20.67,10.06 R25.2
N$12
  Top 0.15: R2.2 2,19.16 D2.A
N$13
  Top 0.15: R1.2 2.03,15.76 D1.A
N$41
  Top 0.2: U7.6 26.02,5.02 25.85,5.19 25.85,6.09 26.6,6.84 C29.1
N$42
  Top 0.2: U1.30 8.05,17.22 8.32,17.49 8.32,17.8 C12.1
SD_CD  (via drill 0.2)
  Top 0.15: U1.50 7.5,4.96 7.5,4.25 7.13,3.88 7.13,3.6 6.85,3.33 6.03,3.33 5.83,3.52 5.28,3.52 v5.25,3.5
  Bottom 0.15: v5.25,3.5 4.82,3.93 J2.CD
SDIO_CK  (via drill 0.2)
  Top 0.15: U1.53 9.05,6.55 9.2,6.7 9.2,10.8 v8.75,11.25
  Bottom 0.15: v8.75,11.25 8.36,11.25 7.74,11.88 7.72,11.9 6.35,11.9 4.7,10.25 2.21,10.25 J2.5
SDIO_CMD  (via drill 0.2)
  Top 0.15: U1.54 9.51,5.02 9.51,11.5 8.74,12.27 v8.17,12.27
  Bottom 0.15: J2.3 6.14,12.61 6.5,12.25 8.15,12.25 v8.17,12.27
SDIO_D0  (via drill 0.2)
  Top 0.15: v0.69,8.19 0.67,8.21 0.67,8.88 0.95,9.14 R32.3 1.99,9.14 2.05,9.08 J2.7 2.75,7.51 2.75,6.5 3.32,5.93 v3.32,5.88 | U1.39 6.74,11.51 7,11.25 v7.49,11.25 v7.5,11.26
  Bottom 0.15: v0.69,8.19 J2.7 | v7.5,11.26 7.5,10.25 7.25,10 5.37,10 4.82,9.46 4.82,6.78 3.93,5.88 v3.32,5.88
SDIO_D1  (via drill 0.2)
  Top 0.15: R32.1 1.4,6.85 v2.04,6.21 | U1.40 6.54,11.01 v6.82,10.73
  Bottom 0.15: v2.04,6.21 J2.8 4.11,7.11 4.5,7.5 4.5,9.6 5.39,10.49 6.58,10.49 v6.82,10.73
SDIO_D2  (via drill 0.2)
  Top 0.15: R32.7 1.4,14.6 1.25,14.75 v0.74,14.75 v0.73,14.74 | v7.37,12.88 7.36,12.24 8.13,11.5 8.13,10.77 8.83,10.06 8.83,8.91 7.77,7.85 7.77,7.33 8.04,7.06 U1.51
  Bottom 0.15: v0.73,14.74 1.98,14.74 J2.1 3.43,14.82 4.5,13.75 6.5,13.75 v7.37,12.88
SDIO_D3  (via drill 0.2)
  Top 0.15: 1,10 0.75,10.25 v0.75,13.7 | R32.5 1.06,9.94 1,10 | 1,10 1,9.98 v0.67,9.67 | v8.54,7.33 U1.52
  GND 0.15: v0.67,9.67 0.67,9.09 2.43,7.33 v8.54,7.33
  Bottom 0.15: v0.75,13.7 J2.2
SPKL+  (via drill 0.2)
  Top 0.2: U2.19 23.75,10.59 23.75,9.61 v24.09,9.3
  Bottom 0.2: v24.09,9.3 31.9,1.35 J4.1
SPKL-  (via drill 0.2)
  Top 0.2: U2.20 24.28,9.92 v24.94,9.26
  Bottom 0.2: v24.94,9.26 31.45,2.75 33.25,2.75 34.52,1.48 J4.2
SPKR+  (via drill 0.2)
  Top 0.2: U2.23 25.78,9.97 26,9.75 26.25,9.75 v26.75,9.25
  Bottom 0.2: v26.75,9.25 26.75,8.85 31.65,3.95 37,3.95 J4.4
SPKR-  (via drill 0.2)
  Top 0.2: U2.22 25.25,10.59 25.25,9.75 v25.75,9.25
  Bottom 0.2: v25.75,9.25 31.5,3.5 34.91,3.5 J4.3
SWDCLK  (via drill 0.2)
  Top 0.15: U1.49 7,5.06 7,5.75 7.5,6.25 7.47,6.28 v7.47,6.75
  Bottom 0.15: U$1.2 29.43,16.93 29,16.5 22.5,16.5 22.5,16.47 21.18,15.15 19.92,15.14 19.44,14.66 19.44,12.71 16.75,10 14.5,10 11.25,6.75 v7.47,6.75
SWDIO  (via drill 0.2)
  Top 0.15: U1.46 5.99,8.01 6.25,7.75 6.24,7.74 v6.24,6.42
  Bottom 0.15: v6.24,6.42 6.5,6.16 11.13,6.16 14.64,9.67 16.94,9.67 19.77,12.5 19.77,14.5 20.07,14.8 21.39,14.8 22.76,16.17 29.93,16.17 30,16.24 30,16.25 31.63,17.88 U$1.3
USART1_RX  (via drill 0.2)
  Top 0.15: v6.25,9.25 5.99,9.51 U1.43
  Bottom 0.15: J5.3 5.85,2.08 5.85,5.65 5.14,6.36 5.14,8.94 5.45,9.25 v6.25,9.25
USART1_TX
  Top 0.15: U1.42 5.07,9.99 6.14,9.99 6.33,9.8 6.35,9.8 6.37,9.78 7.21,9.78 7.58,9.41 7.58,8.25 6.78,7.45 6.78,6.07 6.5,5.79 6.5,5 5.95,4.45 5.94,4.45 5.93,4.44 5.3,4.44 4.75,3.89 4.75,3.71 4.04,3 J5.2
VCC  (via drill 0.2, 0.3)
  Top 0.15: R32.8 R32.6 R32.4 R32.2 3.25,8.19 3.25,7 3.69,6.56 v3.79,6.56 | v3.82,17.19 3.14,17.96 R2.1 | R3.2 7.86,3.53 v7.86,2.53 8.08,2.75 10,2.75 10.73,3.48 R4.2 | R5.2 17.82,7.01 U1.1 | R1.1 3.43,14.9 v4.1,14.95
  Top 0.2: 3.12,17.98 R2.1 | U1.32 6.38,16.51 v6.36,16.53 C4.1 | C1.1 13.81,17.94 v13.77,17.9 13.77,17.48 13.56,17.27 U1.19 | U2.10 21.21,14.4 | 21.21,14.4 20.62,14.4 v20.34,14.19 | U2.11 21.25,13.9 21.22,13.87 21.22,14.39 21.21,14.4 | U3.3 30.33,9.25 v30.99,9.25 | U1.13 15.75,13 15.25,12.5 15.25,12 14.75,11.5 14.72,11.53 v14.11,11.53 | C2.1 15,3.8 14.56,4.24 U1.64 14.56,5.65 15.91,7 15.95,7 15.96,7.01 U1.1 | U1.48 5.05,6.57 C3.1 4.38,6.56 v3.79,6.56 | U3.1 v28.29,9.29 | U7.7 26.01,4.33 25.93,4.25 25.93,3.73 U7.8
  Top 0.3: C9.1 30.28,9.24 U3.3
  Top 0.406: v3.89,10.84 R32.8 | C28.1 3.14,12.33 v3.89,11.99 | v25.18,6 25.25,5.44 D6-DNP.C 25.18,4.54 25.4,4.33 26.01,4.33 | v15.36,2.53 15,2.89 C2.1 | C15.1 27.85,2.43 27.55,2.73 27.54,2.73 27.38,2.89 26.51,2.89 26.46,2.89 U7.8 | 25.92,4.24 25.93,4.25 | J6.2 34.59,4.34 35,4.75 v36,4.75
  VCC 0.406: v3.89,11.99 3.9,10.86 v3.89,10.84
  Bottom 0.406: J2.4 3.89,11.51 3.91,11.5 3.91,11.99 v3.89,11.99
  pour VCC: -2,25 -2,-2.25 46.25,-2.25 46.25,25
(copper drawn outside any net)
  shapes: Top area x2

### Text on the board
tPlace: L | 16 | 15 | 14 | 13 | 12 | 11 | 10 | 9 | 8 | 7 | 6 | 5 | 4 | 3 | 2 | 1 | R1.2 | L+ | L- | R- | R+
bPlace: BOOT | GND | CLK | DIO | 3.3V | 6-12V | RST | P5V | GND | GND | TX | RX | GND | 5V | 3.3V
Measures: All dimensions are in millimeters